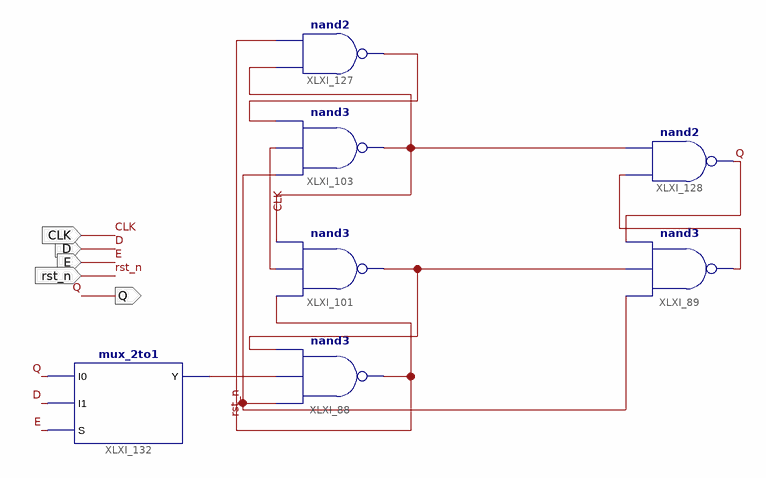
[diagram p0: schematic sheet 1]
// Xilinx ISE schematic d_ff.sch (virtex6) as structural Verilog: 7 symbols, 5 ports
module d_ff (
  input  CLK,
  input  D,
  input  rst_n,
  input  E,
  output Q
);

  wire XLXN_94, XLXN_96, XLXN_101, XLXN_102, XLXN_159, XLXN_235;

  nand XLXI_88 (XLXN_101, rst_n, XLXN_235, XLXN_102);
  nand XLXI_101 (XLXN_102, XLXN_101, CLK, XLXN_96);
  nand XLXI_103 (XLXN_96, rst_n, CLK, XLXN_94);
  nand XLXI_89 (XLXN_159, rst_n, XLXN_102, Q);
  nand XLXI_127 (XLXN_94, XLXN_96, XLXN_101);
  nand XLXI_128 (Q, XLXN_159, XLXN_96);
  mux_2to1 XLXI_132 (.I0(Q), .I1(D), .S(E), .Y(XLXN_235));
endmodule
